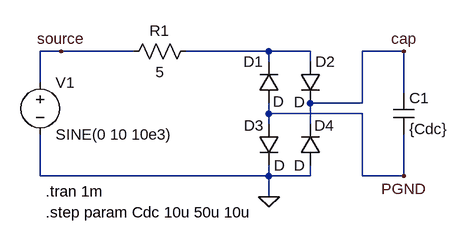
[diagram p0: schematic rectifier.asc]
rectifier.asc, the LTspice schematic file:
Version 4
SHEET 1 880 680
WIRE 80 80 48 80
WIRE 192 80 80 80
WIRE 400 80 272 80
WIRE 464 80 400 80
WIRE 608 80 544 80
WIRE 400 96 400 80
WIRE 464 96 464 80
WIRE 48 128 48 80
WIRE 608 144 608 80
WIRE 544 160 544 80
WIRE 544 160 464 160
WIRE 400 176 400 160
WIRE 544 176 400 176
WIRE 400 192 400 176
WIRE 464 192 464 160
WIRE 48 272 48 208
WIRE 400 272 400 256
WIRE 400 272 48 272
WIRE 464 272 464 256
WIRE 464 272 400 272
WIRE 544 272 544 176
WIRE 608 272 608 208
WIRE 608 272 544 272
WIRE 400 304 400 272
FLAG 80 80 source
FLAG 400 304 0
FLAG 608 272 PGND
FLAG 608 80 cap
SYMBOL voltage 48 112 R0
WINDOW 123 0 0 Left 0
WINDOW 39 0 0 Left 0
SYMATTR InstName V1
SYMATTR Value SINE(0 10 10e3)
SYMBOL res 288 64 R90
WINDOW 0 0 56 VBottom 2
WINDOW 3 32 56 VTop 2
SYMATTR InstName R1
SYMATTR Value 5
SYMBOL diode 416 160 R180
WINDOW 0 24 64 Left 2
WINDOW 3 -8 3 Left 2
SYMATTR InstName D1
SYMBOL diode 448 96 R0
WINDOW 3 -9 62 Left 2
SYMATTR InstName D2
SYMBOL diode 384 192 R0
WINDOW 0 -22 2 Left 2
SYMATTR InstName D3
SYMBOL diode 480 256 R180
WINDOW 0 -21 62 Left 2
WINDOW 3 24 0 Left 2
SYMATTR InstName D4
SYMBOL cap 592 144 R0
SYMATTR InstName C1
SYMATTR Value {Cdc}
TEXT 56 296 Left 2 !.tran 1m
TEXT 56 328 Left 2 !.step param Cdc 10u 50u 10u

The netlist it stands for:
* rectifier.asc
V1 source 0 SINE(0 10 10e3)
R1 N001 source 5
D1 PGND N001 D
D2 N001 cap D
D3 PGND 0 D
D4 0 cap D
C1 cap PGND {Cdc}
.model D D
.lib standard.dio
.tran 1m
.step param Cdc 10u 50u 10u
.backanno
.end

* Results of the author's LTspice run, read from the files saved beside the schematic
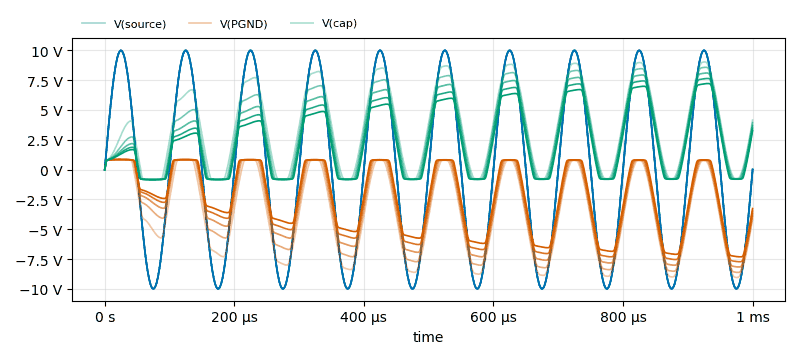
[diagram p1: Transient Analysis of rectifier.asc, plotted from the saved traces]
* Transient Analysis, 5 runs:
*   V(source) [run 1]: min -9.99 V, max 9.99 V, average 40.68 µV, rms 7.068 V, last 0 V
*   V(source) [run 2]: min -9.99 V, max 9.99 V, average 2.116 µV, rms 7.068 V, last 0 V
*   V(source) [run 3]: min -9.99 V, max 9.99 V, average -108.7 µV, rms 7.067 V, last 0 V
*   V(source) [run 4]: min -9.99 V, max 9.99 V, average -137.7 µV, rms 7.067 V, last 0 V
*   V(source) [run 5]: min -9.99 V, max 9.99 V, average -174.4 µV, rms 7.067 V, last 0 V
*   V(PGND) [run 1]: min -9.04 V, max 840.5 mV, average -3.639 V, rms 5.013 V, last -4.15 V
*   V(PGND) [run 2]: min -8.618 V, max 843.4 mV, average -3.158 V, rms 4.551 V, last -3.928 V
*   V(PGND) [run 3]: min -8.165 V, max 844.5 mV, average -2.794 V, rms 4.178 V, last -3.696 V
*   V(PGND) [run 4]: min -7.725 V, max 845.1 mV, average -2.508 V, rms 3.87 V, last -3.472 V
*   V(PGND) [run 5]: min -7.315 V, max 845.4 mV, average -2.275 V, rms 3.61 V, last -3.265 V
*   V(cap) [run 1]: min -828.8 mV, max 9.02 V, average 3.528 V, rms 4.878 V, last 4.15 V
*   V(cap) [run 2]: min -837 mV, max 8.57 V, average 3.043 V, rms 4.412 V, last 3.928 V
*   V(cap) [run 3]: min -840 mV, max 8.093 V, average 2.681 V, rms 4.039 V, last 3.696 V
*   V(cap) [run 4]: min -841.6 mV, max 7.635 V, average 2.397 V, rms 3.732 V, last 3.472 V
*   V(cap) [run 5]: min -842.6 mV, max 7.212 V, average 2.168 V, rms 3.475 V, last 3.265 V